# Altium schematic sheet V2.0.SchDoc
size 165 x 88 mm; PageSetup: Record=PageOptions|CenterHorizontal=True|CenterVertical=True|PrintScale=0.71|XCorrection=1.00|YCorrection=1.00|PrintKind=1|BorderSize=5000000|LeftOffset=0|BottomOffset=0|Orientation=2|PaperLength=1000|PaperWidth=1000|Scale=100|PaperSource=15|PrintQuality=4000|MediaType=1|DitherType=10|PrintScaleMode=1|PaperKind=A4|PaperIndex=9
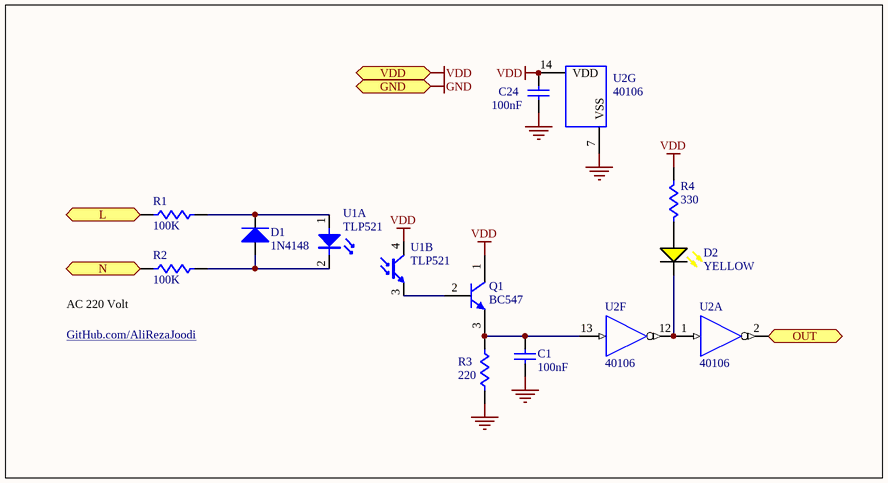
[diagram p0: V2.0.SchDoc]

## Parts
C1  100nF  [CAPNTO5.08-7.37x3.94]
C24  100nF  [0805]
D1  1N4148  [DIODE0.2_]
D2  YELLOW  [LED_THD_5MM_YELLOW]
Q1  BC547  [TO92C]
R1  100K  [AXIAL-0.4]
R2  100K  [AXIAL-0.4]
R3  220  [AXIAL-0.4]
R4  330  [0805]
U1  TLP521  [DIP-4]  (parts A,B of 2)
U2  40106  [DIP14]  (parts A,F,G of 7)

## Ports
GND (in), L (in), N (in), OUT (out), VDD (in)

## Nets
GND: C1.1 C24.2 R3.2 U2.7(VSS) ; port GND
VDD: C24.1 Q1.1(C) R4.2 U1.4(C) U2.14(VDD) ; port VDD
L: R1.1 ; port L
N: R2.1 ; port N
OUT: U2.2(~{O}) ; port OUT
NetC1_2: C1.2 Q1.3(E) R3.1 U2.13(I)
NetD1_1: D1.1(A) R2.2 U1.2(K)
NetD1_2: D1.2(K) R1.2 U1.1(A)
NetD2_1: D2.1(A) R4.1
NetD2_2: D2.2(K) U2.1(I) U2.12(~{O})
NetQ1_2: Q1.2(B) U1.3(E)

## Notes on the sheet
- GitHub.com/AliRezaJoodi
- (near R2) AC 220 Volt

## Library data of the parts
C1 = Cap: Capacitor; Manufacturer: Generic Components; Class I: Passive; Published: 8-Jun-2000; Revision: July-2002: Re-released for DXP Platform.; Publisher: Altium Limited; Class II: Capacitor
C24 = Cap: Capacitor; Published: 8-Jun-2000; LatestRevisionDate: 17-Jul-2002; LatestRevisionNote: Re-released for DXP Platform.; PackageReference: RAD-0.3; Publisher: Altium Limited
D1 = Diode: Default Diode; Manufacturer: Generic Components; Class I: Discrete; Class II: Diode - Switching; Published: 8-Jun-2000; Revision: July-2002: Re-released for DXP Platform.; Publisher: Altium Limited
D2 = LED_YELLOW: LED, Yellow; Manufacturer: Generic Components; Class I: Optoelectronic; Published: 8-Jun-2000; Revision: July-2002: Re-released for DXP Platform.; Publisher: Altium Limited; Class II: LED
Q1 = NPN: Silicon Bipolar Transistor; Package Reference: TO-92A
R1-R4 = Res1: Resistor; Manufacturer: Generic Components; Class I: Passive; Published: 8-Jun-2000; Revision: July-2002: Re-released for DXP Platform.; Publisher: Altium Limited; Class II: Resistor
U1 = Optoisolator: Publisher: Altium Limited
U2 = 40106: Hex inverting Schmitt trigger, 14-Pin; Publisher: Altium Limited; ComponentLink1URL: http://www.nxp.com